# EAGLE design lm8039-sx1276-atmel328p-v0.1 (EAGLE 9.4.0)

## Sheet 1 of 3
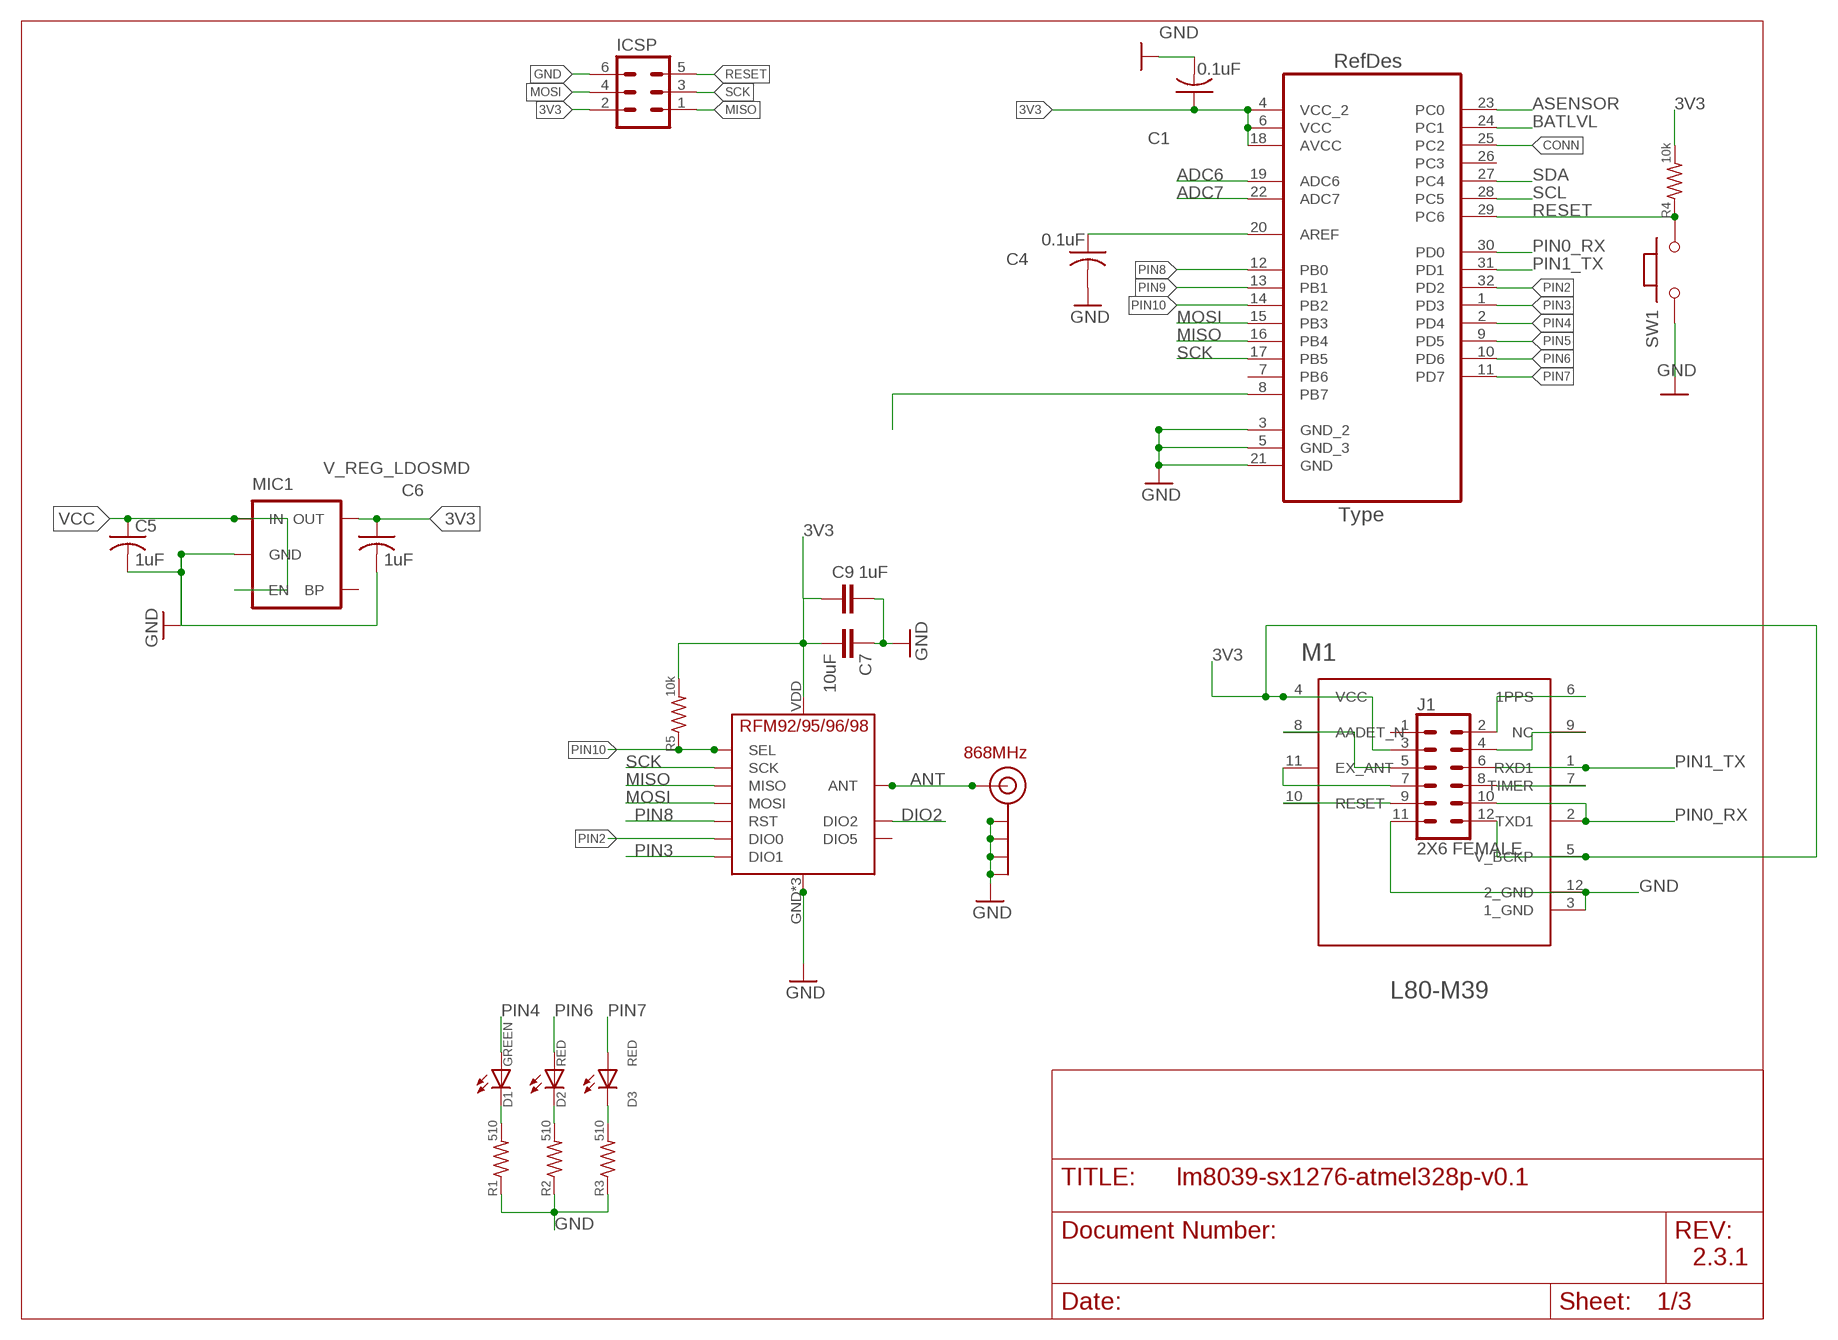
[diagram p0: schematic, sheet 1]

### Parts
C1  0.1uF  C-USC0805  [C0805]
C4  0.1uF  C-USC0805  [C0805]
C5  1uF  C-USC0805  [C0805]
C6  1uF  C-USC0805  [C0805]
C7  10uF  CAP0805-CAP-LARGEPADS  [0805-CAP-LARGEPADS]
C9  1uF  CAP0805-CAP-LARGEPADS  [0805-CAP-LARGEPADS]
D1  GREEN  LED-0603  [LED0603]
D2  RED  LED-0603  [LED0603]
D3  RED  LED-0603  [LED0603]
ICSP  MA03-2  [MA03-2]
J1  2X6 FEMALE  CONN_06X2PTH_FEMALE  [2X6]
J$2  ANTENNATINY  [SMA_UFL_PAD_TINY]
M1  QUECTEL_L80-M39QUECTEL_L80-M39_0_0  [QUECTEL_L80-M39_0]
MIC1  V_REG_LDOSMD  [SOT23-5]
R1  510  R-US_R0603  [R0603]
R2  510  R-US_R0603  [R0603]
R3  510  R-US_R0603  [R0603]
R4  10k  R-US_R0603  [R0603]
R5  10k  R-US_R0603  [R0603]
SW1  RESET  MYSMD_PB157  [SMD_157SW]
U1  ATMEGA328P-AU  [QFP80P900X900X120-32N]
U$5  RFM95  [RFM95]

### Nets
3V3: C1.1 C6.1 C7.2 C9.2 ICSP.2 J1.3 J1.12 M1.4(VCC) M1.5(V_BCKP) MIC1.5(OUT) R4.2 R5.2 U1.4(VCC_2) U1.6(VCC) U1.18(AVCC) U$5.VDD(VCC)
ADC6: U1.19(ADC6)
ADC7: U1.22(ADC7)
ANT: J$2.ANT1(SIGNAL) J$2.ANT2(SIGNAL) J$2.ANT3(SIGNAL) U$5.ANT
ASENSOR: U1.23(PC0)
BATLVL: U1.24(PC1)
CONN: U1.25(PC2)
DIO2: U$5.DIO2
GND: C1.2 C4.2 C5.2 C6.2 C7.1 C9.1 ICSP.6 J1.11 J$2.GND1(GND) J$2.GND2(GND) J$2.GND3(GND) J$2.GND4(GND) M1.3(1_GND) M1.12(2_GND) MIC1.2(GND) R1.1 R2.1 R3.1 SW1.1 U1.3(GND_2) U1.5(GND_3) U1.21(GND) U$5.GND U$5.GND1(GND) U$5.GND2(GND)
MISO: ICSP.1 U1.16(PB4) U$5.MISO
MOSI: ICSP.4 U1.15(PB3) U$5.MOSI
N$3: D3.C R3.2
N$4: C4.1 U1.20(AREF)
N$5: U1.8(PB7)
N$6: J1.2 M1.6(1PPS)
N$7: J1.4 M1.9(NC)
N$9: J1.8 M1.7(TIMER)
N$10: D1.C R1.2
N$11: D2.C R2.2
N$15: J1.9 M1.10(RESET)
N$18: J1.7 M1.11(EX_ANT)
N$26: J1.5 M1.8(AADET_N)
PIN0_RX: J1.10 M1.2(TXD1) U1.30(PD0)
PIN1_TX: J1.6 M1.1(RXD1) U1.31(PD1)
PIN2: U1.32(PD2) U$5.DIO0
PIN3: U1.1(PD3) U$5.DIO1
PIN4: D1.A U1.2(PD4)
PIN5: U1.9(PD5)
PIN6: D2.A U1.10(PD6)
PIN7: D3.A U1.11(PD7)
PIN8: U1.12(PB0) U$5.RST
PIN9: U1.13(PB1)
PIN10: R5.1 U1.14(PB2) U$5.NSS(SEL)
RESET: ICSP.5 R4.1 SW1.2 U1.29(PC6)
SCK: ICSP.3 U1.17(PB5) U$5.SCK
SCL: U1.28(PC5)
SDA: U1.27(PC4)
VCC: C5.1 MIC1.1(IN) MIC1.3(EN)
Unconnected: J1.1 MIC1.4(BP) U1.7(PB6) U1.26(PC3) U$5.DIO5

### Notes on the sheet
- 868MHz
- 2.3.1

## Sheet 2 of 3
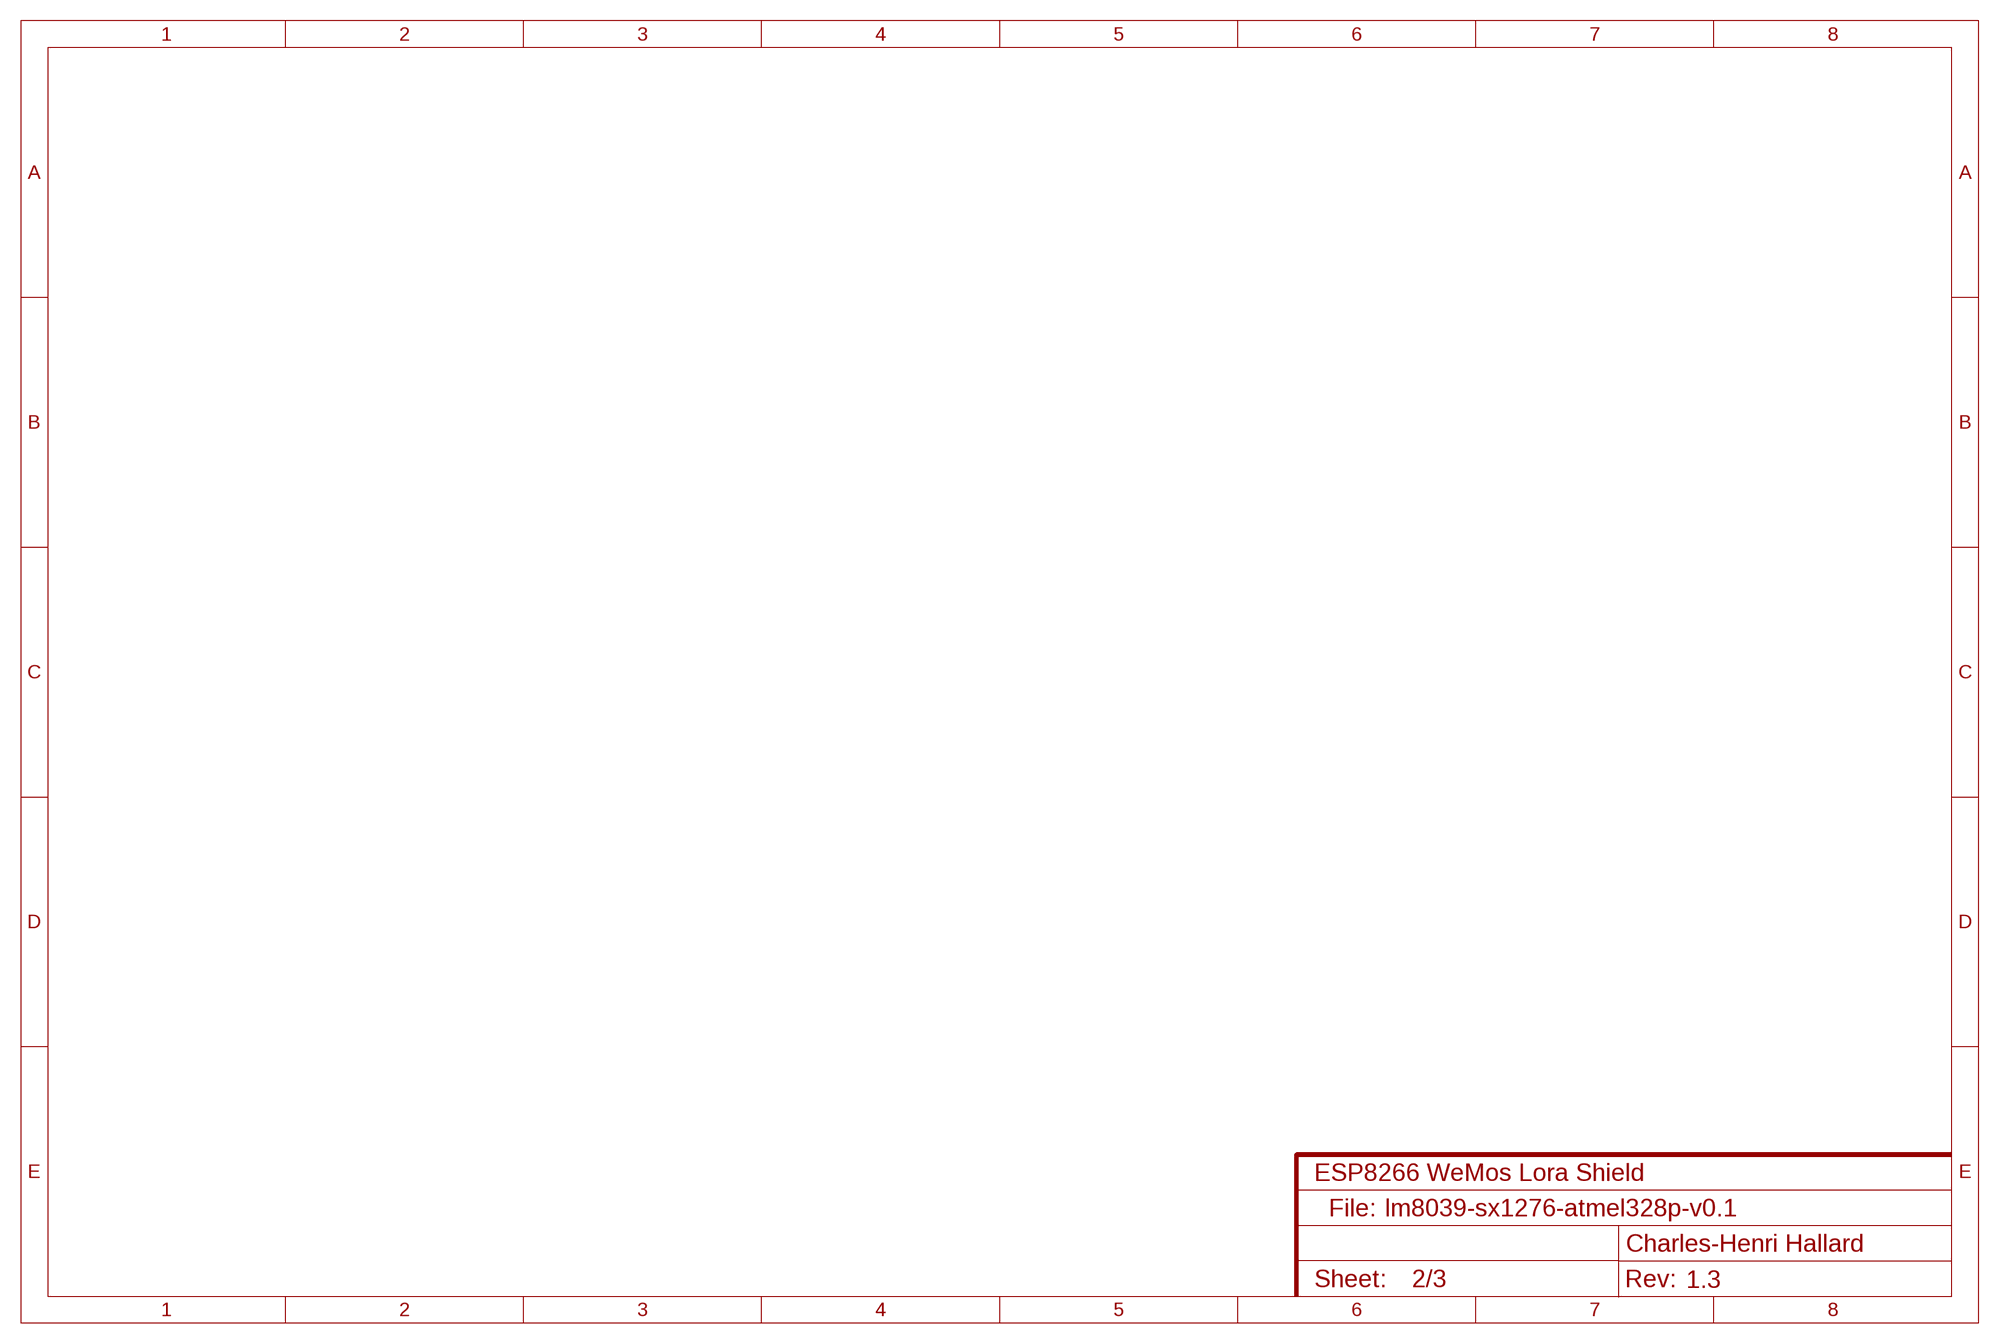
[diagram p1: schematic, sheet 2]
NAME (FRAME-A4L): CNAME: ESP8266 WeMos Lora Shield; CREVISION: 1.3; DESIGNER: Charles-Henri Hallard

### Notes on the sheet
- File:

## Sheet 3 of 3

## Library data of the parts
C1 C4-C6 = resistor:C-US: CAPACITOR, American symbol
C7 C9 = _c2h:CAP: Capacitor Standard 0603 ceramic capacitor, and 0.1" leaded capacitor.
D1-D3 = holla:LED
ICSP = con-lstb:MA03-2: PIN HEADER; OC_FARNELL: unknown; OC_NEWARK: unknown
J1 = SparkFun-Connectors:CONN_06X2: Multi connection point. Often used as Generic Header-pin footprint for 0.1 inch spaced/style header connections On any of the 0.1 inch spaced packages, you can populate with these: Break Away Headers - Straight <https://www.sparkfun.com/products/116> (PRT-00116) Break Away Male Headers - Right Angle <https://www.sparkfun.com/products/553> (PRT-00553) Female Headers <https://www.sparkfun.com/products/115> (PRT-00115) Break Away Headers - Machine Pin <https://www.sparkfun.com/products/117> (PRT-00117) Break Away Female Headers - Swiss Machine Pin <https://www.sparkfun.com/products/743> (PRT-00743); PROD_ID: CONN-12423
J$2 = _c2h:ANTENNA: SMA Antenna Connector End launch SMA connector. The paste layer has been removed so that the connector can be hand soldered onto the board after reflow.
M1 = Quectel - L80-M39:QUECTEL_L80-M39: GPS Receiver 1575.42MHz 3.3V 12-Pin; CENTROID_NOT_SPECIFIED: No; DATASHEET: https://www.quectel.com/UploadImage/Downlad/L80_Hardware_Design_V1.1.pdf; DEVICE_CLASS_L1: unset; DEVICE_CLASS_L2: unset; DEVICE_CLASS_L3: unset; HEIGHT: 7.05mm; LEAD_FREE: yes; MF: Quectel; MFG_PACKAGE_IDENT: L80-M39; MFG_PACKAGE_IDENT_DATE: 0; MFG_PACKAGE_IDENT_REV: 0; MPN: L80-M39; PACKAGE: MODULE_16MM_16MM; PREFIX: M; ROHS: yes; TEMPERATURE_RANGE_HIGH: +85°C; TEMPERATURE_RANGE_LOW: -40°C; VERIFICATION_VERSION: 0.0.0.1
MIC1 = SparkFun:V_REG_LDO: Voltage Regulator LDO Standard 150mA LDO voltage regulator in SOT-23 layout. Micrel part MIC5205. BP (by-pass) pin is used to lower output noise with 470pF cap.
R1-R5 = holla:R
SW1 = Smartprj:MYSMD_PB157
U1 = Brewer_Library:ATMEGA328P-AU; DESCRIPTION: 8-bit Microcontroller with In-System Programmable Flash; MPN: ATMEGA328P-AU; OC_FARNELL: 1715486; OC_NEWARK: 14R4631; PACKAGE: TQFP-32; SUPPLIER: Atmel
U$5 = _c2h:RFM95

## Net classes
0 default: width 0.203 mm, drill 0.356 mm, clearance 0.152 mm

## Board
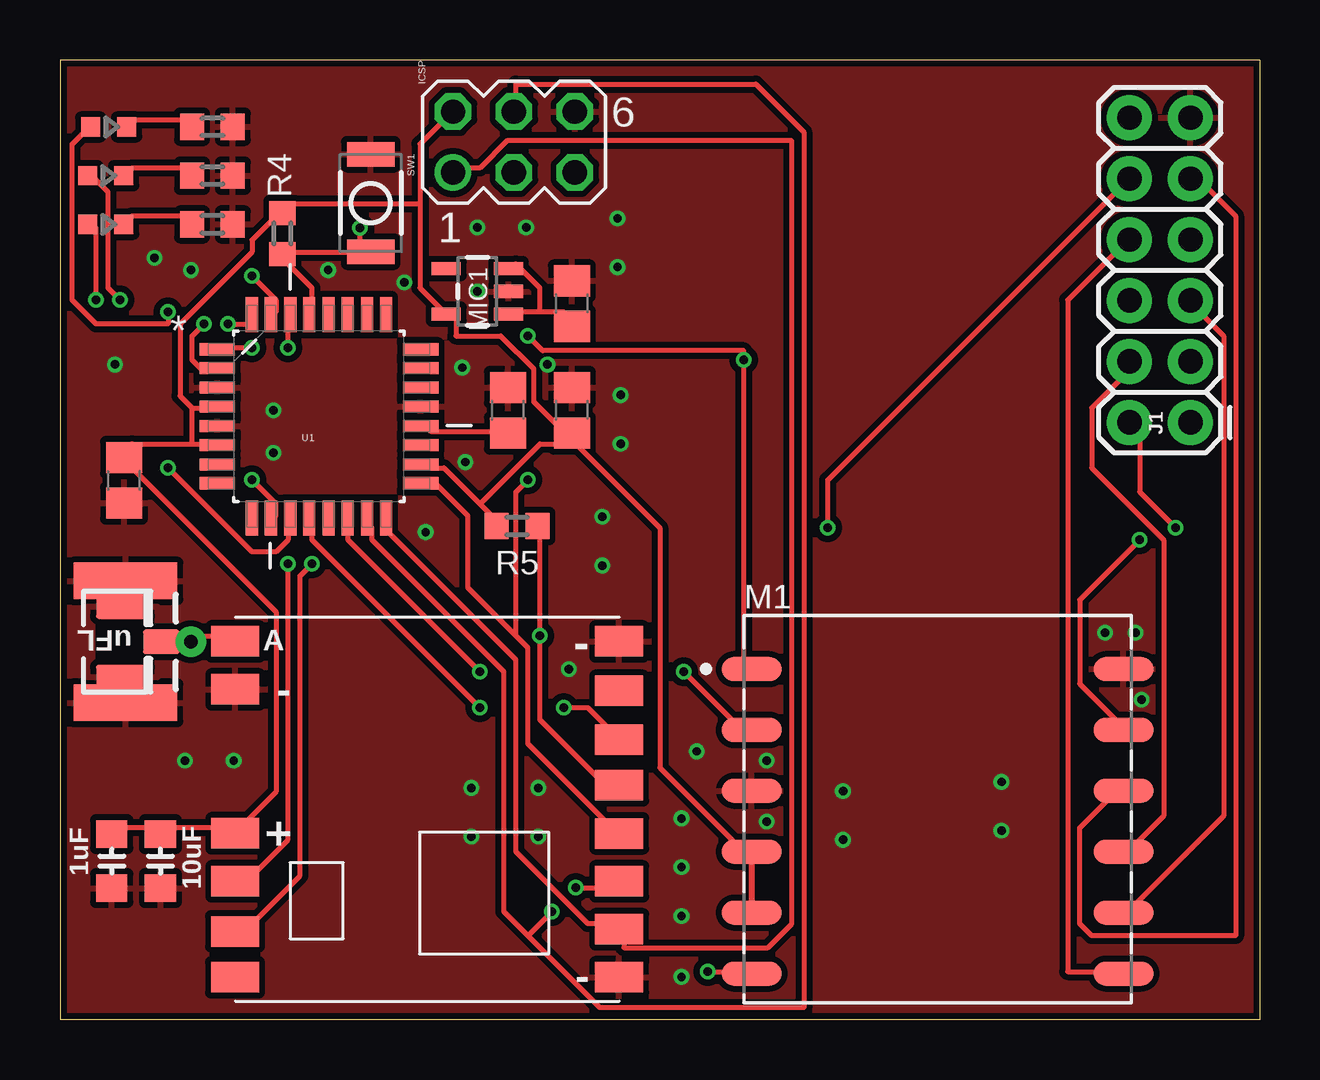
[diagram p2: board, top side]
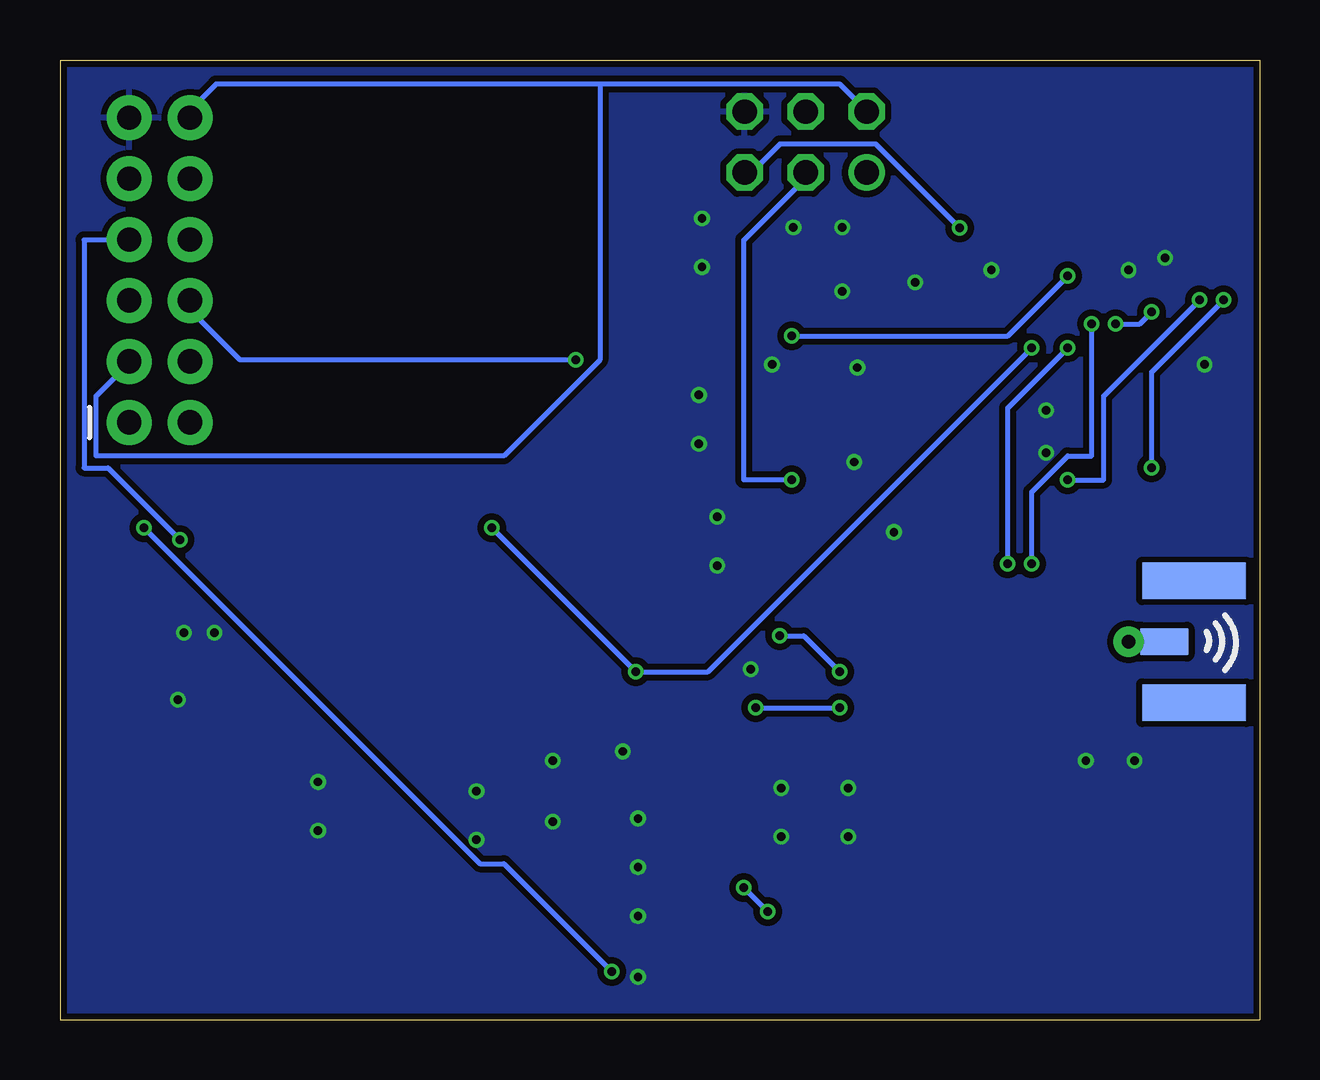
[diagram p3: board, bottom side, seen from below]

Size 50 x 40 mm. Coordinates in mm from the lower left corner, seen from the top.
Outline: 50,40 0,40 0,0 50,0 50,40
Copper layers (1*16): Top 0.035mm / dielectric 1.5mm / Bottom 0.035mm
Design rules "SeeedStudio_2layer_DRU_no_angle_20140221": minimum track width 6mil, minimum drill 12mil, track to track 6mil, track to pad 6mil, pad to pad 6mil, via to via 6mil, smd to smd 0mil, copper to edge 10mil, drill to drill 10mil, minimum pad ring 10mil, minimum via ring 6mil, stop-mask expansion 2mil, vias tented up to drill 100mil, thermal gap 10mil

### Footprints (pad centres in the part's own frame; a part is rotated, then mirrored left to right if it is on the bottom)
C0805 = smd 1.3 x 1.5: 1 -0.95,0; 2 0.95,0
0805-CAP-LARGEPADS = smd 1.156 x 1.3: 1 -1.127,0; 2 1.127,0
LED0603 = smd 0.8 x 0.8: A 0,-0.75; C 0,0.75
MA03-2 = drill 1.016: 1 -2.54,-1.27 | drill 1.016 octagon: 2 -2.54,1.27; 3 0,-1.27; 4 0,1.27; 5 2.54,-1.27; 6 2.54,1.27
2X6 = drill 1.016 pad 1.88: 1 0,0; 2 0,2.54; 3 2.54,0; 4 2.54,2.54; 5 5.08,0; 6 5.08,2.54; 7 7.62,0; 8 7.62,2.54; 9 10.16,0; 10 10.16,2.54; 11 12.7,0; 12 12.7,2.54
SMA_UFL_PAD_TINY = smd 1.524 x 1.016: ANT1 -3.843,0 | drill 0.559 pad 1.27: ANT2 -5.08,0 | smd 2.032 x 1.143 bottom: ANT3 -3.589,0 | smd 2.2 x 1.016: GND1 -2.223,1.47; GND2 -2.223,-1.47 | smd 4.318 x 1.524: GND3 -2.349,-2.54; GND4 -2.349,2.54 | smd 4.318 x 1.524 bottom: GND5 -2.349,2.54; GND6 -2.349,-2.54
QUECTEL_L80-M39_0 = smd 2.5 x 1: 1 -7.75,5.85; 2 -7.75,3.31; 3 -7.75,0.77; 4 -7.75,-1.77; 5 -7.75,-4.31; 6 -7.75,-6.85; 7 7.75,-6.85; 8 7.75,-4.31; 9 7.75,-1.77; 10 7.75,0.77; 11 7.75,3.31; 12 7.75,5.85
SOT23-5 = smd 0.55 x 1.2: 1 -0.95,-1.3; 2 0,-1.3; 3 0.95,-1.3; 4 0.95,1.3; 5 -0.95,1.3
R0603 = smd 1 x 1.1: 1 -0.85,0; 2 0.85,0
SMD_157SW = smd 1.016 x 1.981: 1 -2.032,0; 2 2.032,0
QFP80P900X900X120-32N = smd 1.473 x 0.508: 1 -4.242,2.794; 2 -4.242,2.007; 3 -4.242,1.194; 4 -4.242,0.406; 5 -4.242,-0.406; 6 -4.242,-1.194; 7 -4.242,-2.007; 8 -4.242,-2.794; 17 4.242,-2.794; 18 4.242,-2.007; 19 4.242,-1.194; 20 4.242,-0.406; 21 4.242,0.406; 22 4.242,1.194; 23 4.242,2.007; 24 4.242,2.794 | smd 0.508 x 1.473: 9 -2.794,-4.242; 10 -2.007,-4.242; 11 -1.194,-4.242; 12 -0.406,-4.242; 13 0.406,-4.242; 14 1.194,-4.242; 15 2.007,-4.242; 16 2.794,-4.242; 25 2.794,4.242; 26 2.007,4.242; 27 1.194,4.242; 28 0.406,4.242; 29 -0.406,4.242; 30 -1.194,4.242; 31 -2.007,4.242; 32 -2.794,4.242
RFM95 = smd 2 x 1.27: ANT 5.777,-7; DIO0 5.777,3; DIO1 5.779,5.095; DIO2 5.779,7; DIO5 -10.225,-4.936; GND 5.777,-5; GND1 -10.223,7; GND2 -10.23,-7; MISO -10.23,5; MOSI -10.225,3; NSS -10.223,-1; RST -10.223,-2.905; SCK -10.23,1.012; VDD 5.777,1

### Placement (x,y rotation side)
C1  2.67,22.48 270 top
C4  18.67,25.4 90 top
C5  21.34,29.84 90 top
C6  21.34,25.4 90 top
C7  4.19,6.6 90 top
C9  2.16,6.6 90 top
D1  2.03,37.21 270 top
D2  1.91,35.18 270 top
D3  1.91,33.15 270 top
ICSP  18.92,36.58 0 top
J1  47.12,24.89 90 top
J$2  0.38,15.75 180 top
M1  36.58,8.76 0 top
MIC1  17.4,30.35 90 top
R1  6.35,37.21 180 top
R2  6.35,35.18 180 top
R3  6.35,33.15 180 top
R4  9.27,32.77 90 top
R5  19.05,20.57 180 top
SW1  12.95,34.04 270 top
U1  10.79,25.15 0 top
U$5  13.08,8.76 180 top

### Tracks (layer width: path | path; a pad name or v marks a point on that pad's centre or on a via)
3V3
  Top 0.203: 17.5,21.5 16,23 15.5,23 U1.18 | 17.5,21.5 18,21 R5.2 | 17.5,21.5 20,24 21,24 C6.1 | M1.4 28.5,7 25,10.5 25,20.5 21.5,24 C6.1 | C9.2 2.5,8 4,8 C7.2 4.5,8 7,8 U$5.VDD 7.5,8 9,9.5 9,17 3,23 C1.1 3,23.5 3,24 5.5,24 | 5.5,24 6.5,24 U1.6 | 5.5,25.5 6.5,25.5 U1.4 | 5.5,24 5.5,25.5 | 15,34 9.5,34 R4.2 9,33.5 8,32.5 8,32 5,29 5,26 5.5,25.5 | 15,34 15,36.5 16,37.5 ICSP.2 | 15,34 15,30.5 16,29.5 MIC1.5 16.5,29.5 16.5,28.5 18.37,28.5 19.75,27.13 19.75,25.75 21,24.5 C6.1
  Top 0.254: M1.4 M1.5
  Bottom 0.203: 27.5,39 17.5,39 16.5,38 ICSP.2 | 27.5,39 43.5,39 44.5,38 J1.12 | 27.5,39 27.5,27.5 31.5,23.5 48.5,23.5 48.5,26 47.5,27 J1.3
ANT
  Top 0.203: J$2.ANT1 4.5,16 5,16 J$2.ANT2 5.5,16 7,16 U$5.ANT
  Bottom 0.203: J$2.ANT3 4,16 5,16 J$2.ANT2
GND  (via drill 0.35)
  other vias: 17.14,9.65 19.94,9.65 19.94,7.62 17.14,7.62 25.91,1.78 25.91,4.32 25.91,6.35 25.91,8.38 11.18,31.24 14.35,30.73 17.4,30.35 17.4,33.02 19.43,33.02 23.24,33.4 23.24,31.37 23.37,26.04 23.37,24 22.61,20.95 22.61,18.92 26.54,11.18 32.64,9.53 32.64,7.49 29.46,8.26 29.46,10.79 21.21,14.61 15.24,20.32 5.46,31.24 3.94,31.75 8.89,25.4 8.89,23.62 2.29,27.3 7.24,10.79 5.21,10.79 16.76,27.18 16.89,23.24 20.32,27.3 39.24,9.91 39.24,7.87 43.56,16.13 44.83,16.13 45.09,13.34
  pour Bottom (isolate 0.254): 84.58,56.13 84.58,-0.13 -0.19,-0.13 -0.74,-1.95 0.17,56.13
  pour Top (isolate 0.254): 0.13,52.2 89.28,52.2 89.28,-0.13 0.13,-0.13
MISO
  Top 0.203: U1.16 13.5,20.5 19,15 19,7 22,4 23,4 U$5.MISO 23.5,3.5 23.5,3 29.5,3 30.5,4 30.5,36.63 18.63,36.63 17.5,35.5 16.5,35.5 ICSP.1
MOSI  (via drill 0.36)
  Top 0.203: 19.5,3.5 22.5,0.5 31,0.5 31,37 29,39 19,39 19,38 ICSP.4 | 19.5,3.5 18.5,4.5 18.5,14.5 13,20 13,20.5 U1.15 | v21.5,5.5 23,5.5 U$5.MOSI | 19.5,3.5 v20.5,4.5
  Bottom 0.203: v20.5,4.5 v21.5,5.5
N$3
  Top 0.203: D3.C 3,33.5 5.5,33.5 R3.2
N$4
  Top 0.203: U1.20 15.5,24.5 18.5,24.5 C4.1
N$6  (via drill 0.36)
  Top 0.203: v27,2 28.5,2 M1.6 | v46.5,20.5 45,22 45,24.5 J1.2
  Bottom 0.203: v27,2 31.5,6.5 32.5,6.5 v46.5,20.5
N$7
  Top 0.203: M1.9 44.5,7 46,8.5 46,20 43,23 43,25.5 44.5,27 J1.4
N$9
  Top 0.203: M1.7 44,2 42,2 42,30 44.5,32.5 J1.8
N$10
  Top 0.203: D1.C 3,37.5 5.5,37.5 R1.2
N$11
  Top 0.203: D2.C 3,35.5 5.5,35.5 R2.2
N$15
  Top 0.203: M1.10 44,9.5 42.5,8 42.5,4 43,3.5 49,3.5 49,33.5 47.5,35 J1.9
N$18  (via drill 0.36)
  Top 0.203: v45,20 42.5,17.5 42.5,14 44,12.5 M1.11
  Bottom 0.203: v45,20 48,23 49,23 49,32.5 47.5,32.5 J1.7
N$26
  Top 0.203: M1.8 44.5,4.5 48.5,8.5 48.5,28.5 47.5,29.5 J1.5
PIN0_RX  (via drill 0.36)
  Top 0.203: v9.5,28 9.5,29 U1.30 | v26,14.5 28.5,12 M1.2 | v32,20.5 32,22.5 44.5,35 J1.10
  Bottom 0.203: v9.5,28 23,14.5 v26,14.5 v32,20.5
PIN1_TX  (via drill 0.36)
  Top 0.203: v8,31 9,30 9,29.5 U1.31 | v19.5,28.5 20.12,27.88 28.5,27.88 v28.5,27.5 28.5,15 M1.1
  Bottom 0.203: v8,31 10.5,28.5 v19.5,28.5 | v28.5,27.5 42.5,27.5 44.5,29.5 J1.6
PIN2  (via drill 0.36)
  Top 0.203: v7,29 8,29 U1.32 | v9.5,19 9.5,7.5 7.5,5.5 U$5.DIO0
  Bottom 0.203: v7,29 7,23.5 8,23.5 9.5,22 v9.5,19
PIN3  (via drill 0.36)
  Top 0.203: v8,28 7,28 U1.1 | v10.5,19 10,18.5 10,6 7.5,3.5 U$5.DIO1
  Bottom 0.203: v8,28 10.5,25.5 v10.5,19
PIN4  (via drill 0.36)
  Top 0.203: v4.5,29.5 4.5,29 1.5,29 0.5,30 0.5,36.5 1,37 D1.A | v6,29 5.5,28.5 5.5,27.5 6,27 6.5,27 U1.2
  Bottom 0.203: v4.5,29.5 5,29 v6,29
PIN6  (via drill 0.36)
  Top 0.203: v2.5,30 2,30.5 2,34.5 1.5,35 D2.A | v8,22.5 9,21.5 9,21 U1.10
  Bottom 0.203: v2.5,30 6.5,26 6.5,22.5 v8,22.5
PIN7  (via drill 0.36)
  Top 0.203: v1.5,30 1.5,33 D3.A | v4.5,23 8,19.5 9,19.5 9.5,20 9.5,20.5 U1.11
  Bottom 0.203: v1.5,30 4.5,27 v4.5,23
PIN8  (via drill 0.36)
  Top 0.203: v17.5,13 10.5,20 10.5,20.5 U1.12 | v21,13 22,13 23,12 U$5.RST
  Bottom 0.203: v21,13 v17.5,13
PIN10  (via drill 0.36)
  Top 0.203: R5.1 20,20.5 v20,16 20,12.5 23,9.5 U$5.NSS | v17.5,14.5 12,20 12,20.5 U1.14
  Bottom 0.203: v17.5,14.5 19,16 v20,16
RESET  (via drill 0.36)
  Top 0.203: U1.29 10.5,29.5 10.5,30.5 9.5,31.5 R4.1 9.5,32 12.5,32 SW1.2 12.5,32.5 v12.5,33
  Bottom 0.203: v12.5,33 16,36.5 20,36.5 21,35.5 ICSP.5
SCK  (via drill 0.36)
  Top 0.203: 19,16 19.5,15.5 19.5,11.5 23,8 U$5.SCK | 19,16 17,18 17,21 15.5,22.5 U1.17 | v19.5,22.5 19,22 19,16
  Bottom 0.203: v19.5,22.5 21.5,22.5 21.5,32.5 19,35 ICSP.3
VCC
  Top 0.203: 20,29.5 21,29.5 21,29 C5.1 | 20,29.5 19,29.5 MIC1.1 | 20,29.5 20,30.5 19,31.5 MIC1.3